# Altium project PCB_Gongkong.PrjPCB
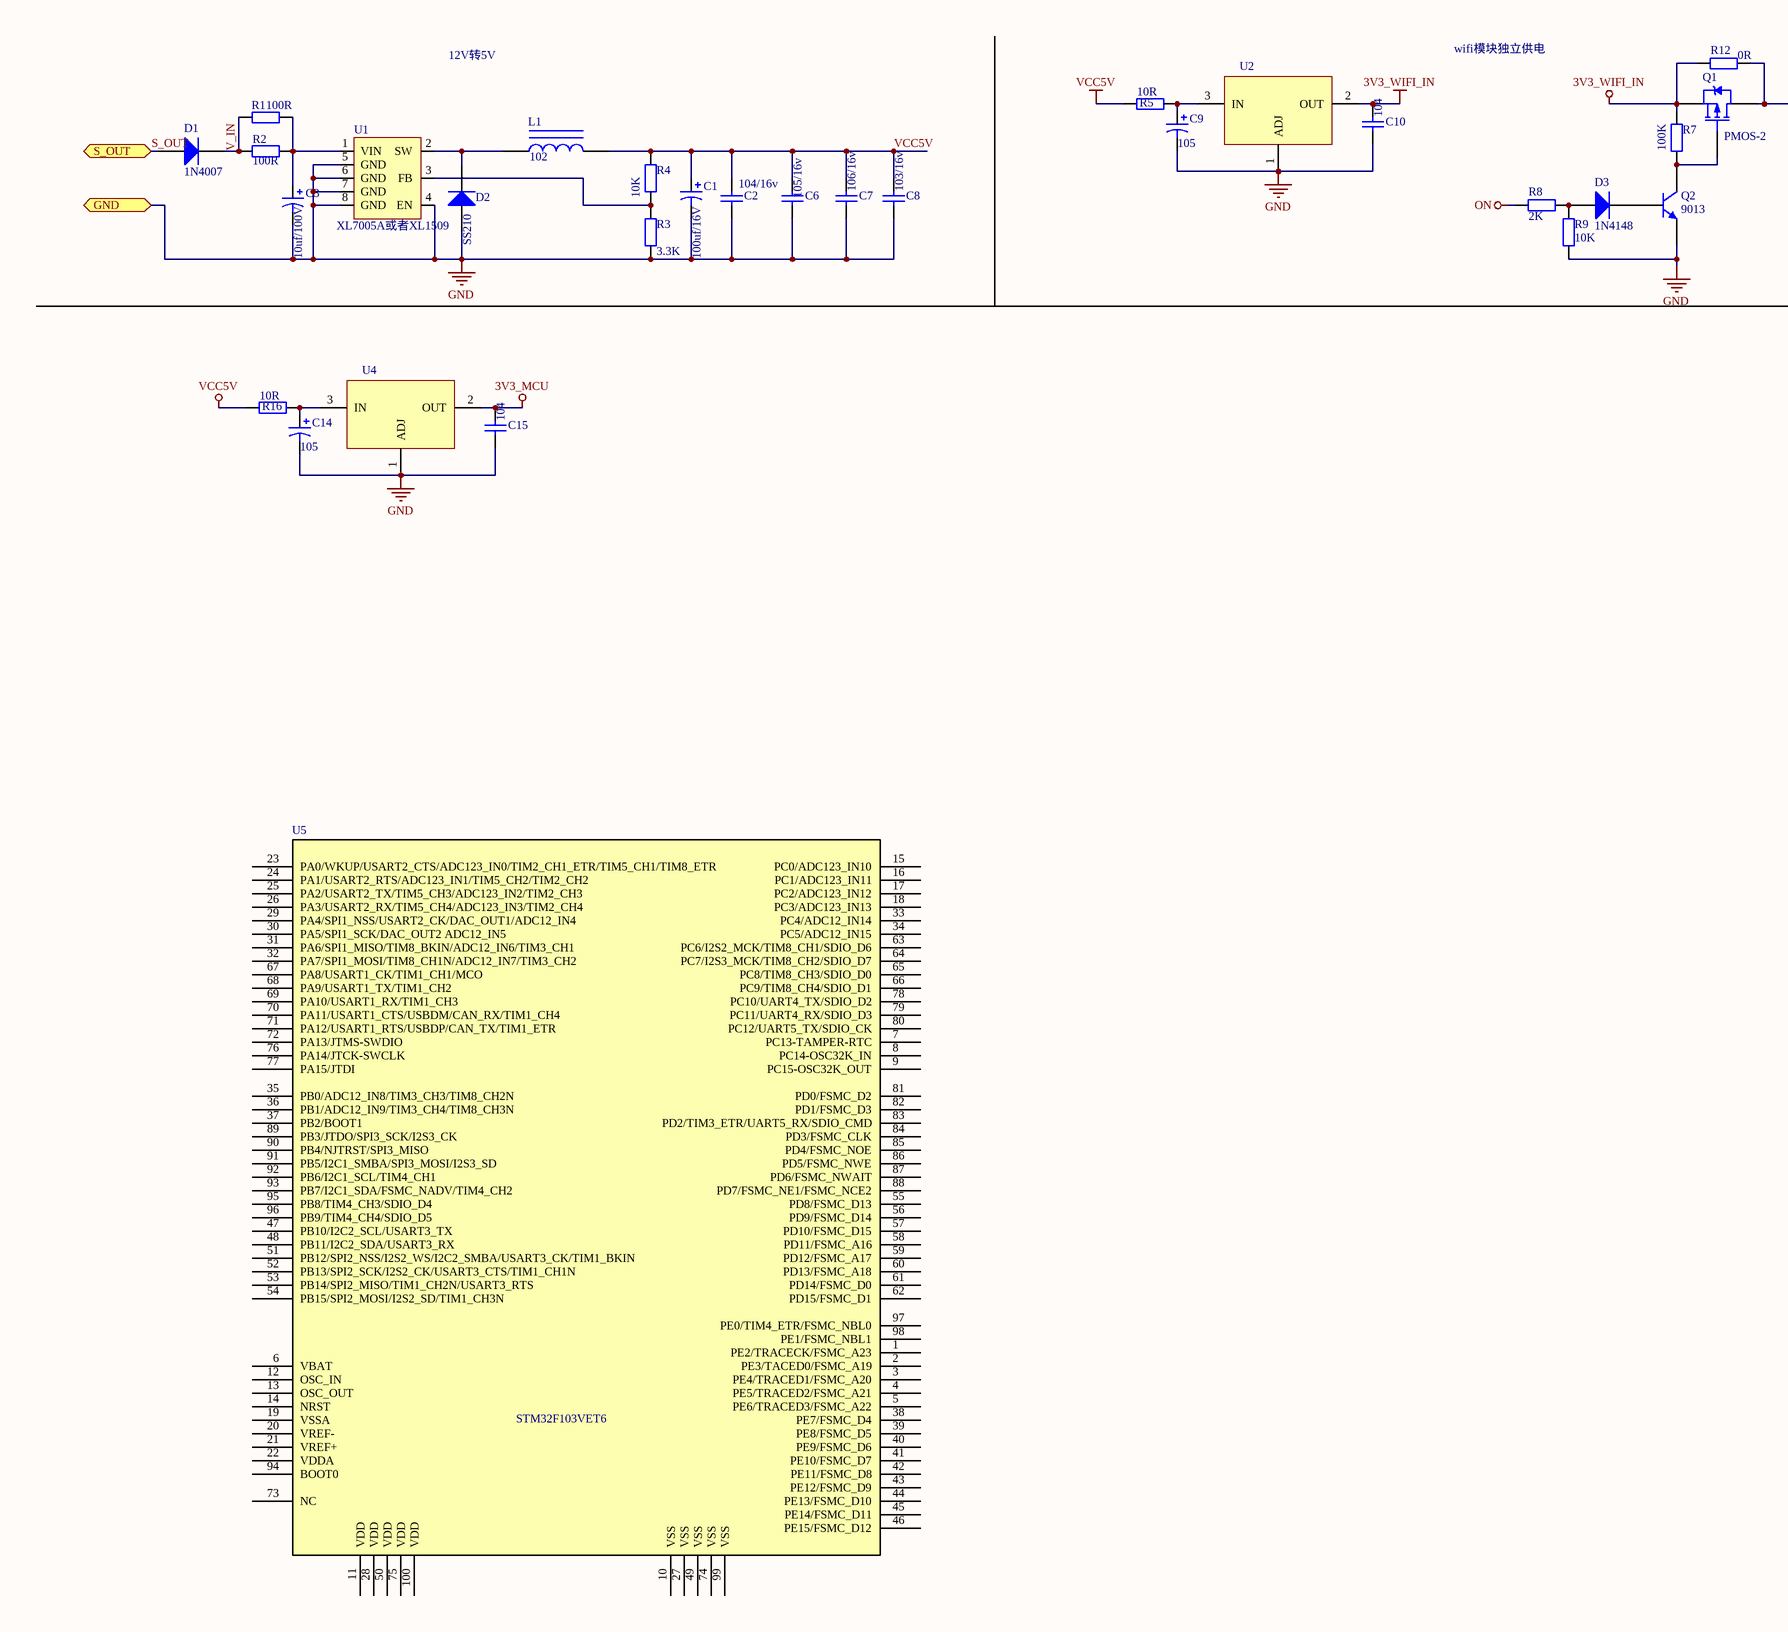
[diagram p0: GongKong.SchDoc, left]
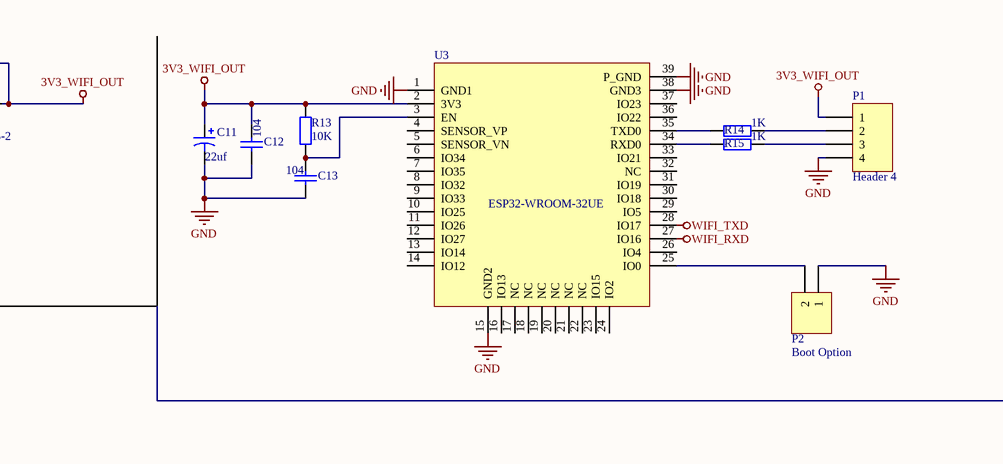
[diagram p1: GongKong.SchDoc, right]
1 sheet, 39 parts. Net scope: flat (ports and power ports of the same name join across sheets).

## Sheet GongKong.SchDoc
size A2

### Parts
C1  value 100uf/16V  [47uf/25V]  (hidden comment: Cap Pol1)
C2  value 104/16v  [0805-JT]  (hidden comment: Cap)
C3  value 10uf/100V  [47uf/25V]  (hidden comment: Cap Pol1)
C6  value 105/16v  [0805-JT]  (hidden comment: Cap)
C7  value 106/16v  [0805-JT]  (hidden comment: Cap)
C8  value 103/16v  [0805-JT]  (hidden comment: Cap)
C9  value 105  [RB7.6-15]  (hidden comment: Cap Pol1)
C10  value 104  [0805-JT]  (hidden comment: Cap)
C11  value 22uf  [RB7.6-15]  (hidden comment: Cap Pol1)
C12  value 104  [0805-JT]  (hidden comment: Cap)
C13  value 104  [0805-JT]  (hidden comment: Cap)
C14  value 105  [RB7.6-15]  (hidden comment: Cap Pol1)
C15  value 104  [0805-JT]  (hidden comment: Cap)
D1  1N4007  [M7 - WX]
D2  SS210  [M7 - WX]
D3  1N4148  [SMC]
L1  value 102  [CD54]  (hidden comment: Inductor Iron)
P1  Header 4  [HDR1X4]
P2  Boot Option  [HDR1X2]
Q1  PMOS-2  [TO-220AB]
Q2  9013  [TO-226-AA]
R1  value 100R  [1206]  (hidden comment: Res2)
R2  value 100R  [1206]  (hidden comment: Res2)
R3  value 3.3K  [0603-JT]  (hidden comment: Res2)
R4  value 10K  [0603-JT]  (hidden comment: Res2)
R5  value 10R  [1206]  (hidden comment: Res2)
R7  value 100K  [0603-JT]  (hidden comment: Res2)
R8  value 2K  [0603-JT]  (hidden comment: Res2)
R9  value 10K  [0603-JT]  (hidden comment: Res2)
R12  value 0R  [0603-JT]  (hidden comment: Res2)
R13  value 10K  [0603-JT]  (hidden comment: Res2)
R14  value 1K  [0603-JT]  (hidden comment: Res2)
R15  value 1K  [0603-JT]  (hidden comment: Res2)
R16  value 10R  [1206]  (hidden comment: Res2)
U1  XL7005A或者XL1509  [SOP8]
U2  1117_3V3  [SOT-223-jt]  (value not drawn)
U3  ESP32-WROOM-32UE  (value not drawn)
U4  1117_3V3  [SOT-223-jt]  (value not drawn)
U5  STM32F103VET6  [LQFP-100]

### Ports
GND, S_OUT

### Nets
3V3_MCU: C15.2 U4.2(OUT)
3V3_WIFI_IN: C10.2 Q1.3(S) R7.1 R12.2 U2.2(OUT)
3V3_WIFI_OUT: C11.1 C12.2 P1.1 Q1.2(D) R12.1 R13.1 U3.2(3V3)
GND: C1.2 C2.1 C3.2 C6.1 C7.1 C8.1 C9.2 C10.1 C11.2 C12.1 C13.1 C14.2 C15.1 D2.1(A) P1.4 P2.1 Q2.3(E) R3.2 R9.1 U1.4(EN) U1.5(GND) U1.6(GND) U1.7(GND) U1.8(GND) U2.1(ADJ) U3.1(GND1) U3.15(GND2) U3.38(GND3) U3.39(P_GND) U4.1(ADJ) ; port GND
ON: R8.1
VCC5V: C1.1 C2.2 C6.2 C7.2 C8.2 L1.2 R4.1 R5.1 R16.1
WIFI_RXD: U3.27(IO16)
WIFI_TXD: U3.28(IO17)
S_OUT: D1.1(A) ; port S_OUT
V_IN: D1.2(K) R1.1 R2.1
NetC3_1: C3.1 R1.2 R2.2 U1.1(VIN)
NetC9_1: C9.1 R5.2 U2.3(IN)
NetC13_2: C13.2 R13.2 U3.3(EN)
NetC14_1: C14.1 R16.2 U4.3(IN)
NetD2_2: D2.2(K) L1.1 U1.2(SW)
NetD3_1: D3.1(A) R8.2 R9.2
NetD3_2: D3.2(K) Q2.2(B)
NetP1_2: P1.2 R14.2
NetP1_3: P1.3 R15.2
NetP2_2: P2.2 U3.25(IO0)
NetQ1_1: Q1.1(G) Q2.1(C) R7.2
NetR3_1: R3.1 R4.2 U1.3(FB)
NetR14_1: R14.1 U3.35(TXD0)
NetR15_1: R15.1 U3.34(RXD0)

Not connected (* = marked no-connect by the designer): U3 4(SENSOR_VP) 5(SENSOR_VN) 6(IO34) 7(IO35) 8(IO32) 9(IO33) 10(IO25) 11(IO26) 12(IO27) 13(IO14) 14(IO12) 16(IO13) 17(NC) 18(NC) 19(NC) 20(NC) 21(NC) 22(NC) 23(IO15) 24(IO2) 26(IO4) 29(IO5) 30(IO18) 31(IO19) 32(NC) 33(IO21) 36(IO22) 37(IO23); U5 1(PE2/TRACECK/FSMC_A23) 2(PE3/TACED0/FSMC_A19) 3(PE4/TRACED1/FSMC_A20) 4(PE5/TRACED2/FSMC_A21) 5(PE6/TRACED3/FSMC_A22) 6(VBAT) 7(PC13-TAMPER-RTC) 8(PC14-OSC32K_IN) 9(PC15-OSC32K_OUT) 10(VSS) 11(VDD) 12(OSC_IN) 13(OSC_OUT) 14(NRST) 15(PC0/ADC123_IN10) 16(PC1/ADC123_IN11) 17(PC2/ADC123_IN12) 18(PC3/ADC123_IN13) 19(VSSA) 20(VREF-) 21(VREF+) 22(VDDA) 23(PA0/WKUP/USART2_CTS/ADC123_IN0/TIM2_CH1_ETR/TIM5_CH1/TIM8_ETR) 24(PA1/USART2_RTS/ADC123_IN1/TIM5_CH2/TIM2_CH2) 25(PA2/USART2_TX/TIM5_CH3/ADC123_IN2/TIM2_CH3) 26(PA3/USART2_RX/TIM5_CH4/ADC123_IN3/TIM2_CH4) 27(VSS) 28(VDD) 29(PA4/SPI1_NSS/USART2_CK/DAC_OUT1/ADC12_IN4) 30(PA5/SPI1_SCK/DAC_OUT2_ADC12_IN5) 31(PA6/SPI1_MISO/TIM8_BKIN/ADC12_IN6/TIM3_CH1) 32(PA7/SPI1_MOSI/TIM8_CH1N/ADC12_IN7/TIM3_CH2) 33(PC4/ADC12_IN14) 34(PC5/ADC12_IN15) 35(PB0/ADC12_IN8/TIM3_CH3/TIM8_CH2N) 36(PB1/ADC12_IN9/TIM3_CH4/TIM8_CH3N) 37(PB2/BOOT1) 38(PE7/FSMC_D4) 39(PE8/FSMC_D5) 40(PE9/FSMC_D6) 41(PE10/FSMC_D7) 42(PE11/FSMC_D8) 43(PE12/FSMC_D9) 44(PE13/FSMC_D10) 45(PE14/FSMC_D11) 46(PE15/FSMC_D12) 47(PB10/I2C2_SCL/USART3_TX) 48(PB11/I2C2_SDA/USART3_RX) 49(VSS) 50(VDD) 51(PB12/SPI2_NSS/I2S2_WS/I2C2_SMBA/USART3_CK/TIM1_BKIN) 52(PB13/SPI2_SCK/I2S2_CK/USART3_CTS/TIM1_CH1N) 53(PB14/SPI2_MISO/TIM1_CH2N/USART3_RTS) 54(PB15/SPI2_MOSI/I2S2_SD/TIM1_CH3N) 55(PD8/FSMC_D13) 56(PD9/FSMC_D14) 57(PD10/FSMC_D15) 58(PD11/FSMC_A16) 59(PD12/FSMC_A17) 60(PD13/FSMC_A18) 61(PD14/FSMC_D0) 62(PD15/FSMC_D1) 63(PC6/I2S2_MCK/TIM8_CH1/SDIO_D6) 64(PC7/I2S3_MCK/TIM8_CH2/SDIO_D7) 65(PC8/TIM8_CH3/SDIO_D0) 66(PC9/TIM8_CH4/SDIO_D1) 67(PA8/USART1_CK/TIM1_CH1/MCO) 68(PA9/USART1_TX/TIM1_CH2) 69(PA10/USART1_RX/TIM1_CH3) 70(PA11/USART1_CTS/USBDM/CAN_RX/TIM1_CH4) 71(PA12/USART1_RTS/USBDP/CAN_TX/TIM1_ETR) 72(PA13/JTMS-SWDIO) 73(NC) 74(VSS) 75(VDD) 76(PA14/JTCK-SWCLK) 77(PA15/JTDI) 78(PC10/UART4_TX/SDIO_D2) 79(PC11/UART4_RX/SDIO_D3) 80(PC12/UART5_TX/SDIO_CK) 81(PD0/FSMC_D2) 82(PD1/FSMC_D3) 83(PD2/TIM3_ETR/UART5_RX/SDIO_CMD) 84(PD3/FSMC_CLK) 85(PD4/FSMC_NOE) 86(PD5/FSMC_NWE) 87(PD6/FSMC_NWAIT) 88(PD7/FSMC_NE1/FSMC_NCE2) 89(PB3/JTDO/SPI3_SCK/I2S3_CK) 90(PB4/NJTRST/SPI3_MISO) 91(PB5/I2C1_SMBA/SPI3_MOSI/I2S3_SD) 92(PB6/I2C1_SCL/TIM4_CH1) 93(PB7/I2C1_SDA/FSMC_NADV/TIM4_CH2) 94(BOOT0) 95(PB8/TIM4_CH3/SDIO_D4) 96(PB9/TIM4_CH4/SDIO_D5) 97(PE0/TIM4_ETR/FSMC_NBL0) 98(PE1/FSMC_NBL1) 99(VSS) 100(VDD)

### Notes on the sheet
- 12V转5V
- wifi模块独立供电

### Library data of the parts
C1 C3 C9 C11 C14 = Cap Pol1: Polarized Capacitor (Radial); Published: 8-Jun-2000; LatestRevisionDate: 17-Jul-2002; LatestRevisionNote: Re-released for DXP Platform.; PackageReference: RB7.6-15; Publisher: Altium Limited; PackageDescription: Polarized Capacitor (Radial); 2 Leads
C2 C6-C8 C10 C12 C13 C15 = Cap: Capacitor; Published: 8-Jun-2000; LatestRevisionDate: 17-Jul-2002; LatestRevisionNote: Re-released for DXP Platform.; PackageReference: RAD-0.3; Publisher: Altium Limited; PackageDescription: Radial Cap, Thru-Hole; 2 Leads; 0.3 in Pin Spacing
D1 D2 = Diode 1N4148: High Conductance Fast Diode; pin to pad: 1>A 2>K; Published: 8-Jun-2000; LatestRevisionDate: 17-Jul-2002; LatestRevisionNote: Re-released for DXP Platform.; DatasheetVersion: 1997; PackageReference: DO-35; Publisher: Altium Limited; PackageDescription: Diode, Axial; Body 3.8 x 1.9 mm (LxDia. max), Lead Dia. 0.53 mm (max); Code_JEDEC: DO-204-AH; ComponentLink1Description: Manufacturer Link; ComponentLink1URL: http://www.fairchildsemi.com/; ComponentLink2Description: Datasheet; ComponentLink2URL: http://www.fairchildsemi.com/ds/1N%2F1N4148.pdf
D3 = Diode: Default Diode; Published: 8-Jun-2000; LatestRevisionDate: 17-Jul-2002; LatestRevisionNote: Re-released for DXP Platform.; PackageVersion: Sep-1996; PackageReference: SMC; Publisher: Altium Limited; PackageDescription: DO-214-AB/SMC; 2 C-Bend Leads; Body 7.9 x 5.9 mm, inc. leads (LxW); Code_JEDEC: DO-214-AB
L1 = Inductor Iron: Magnetic-Core Inductor; Published: 24-Mar-1999; LatestRevisionDate: 17-Jul-2002; LatestRevisionNote: Re-released for DXP Platform.; PackageReference: AXIAL-0.9; Publisher: Altium Limited; PackageDescription: Axial Device, Thru-Hole; 2 Leads; 0.9 in Pin Spacing
P1 = Header 4: Header, 4-Pin; LatestRevisionDate: 17-Jul-2002; LatestRevisionNote: Re-released for DXP Platform.; Publisher: Altium Limited
P2 = Header 2: Header, 2-Pin; LatestRevisionDate: 17-Jul-2002; LatestRevisionNote: Re-released for DXP Platform.; Publisher: Altium Limited
Q1 = PMOS-2: P-Channel Power MOSFET; Note: Pin 4 not drawn and electrically connected to Pin 2.; Published: 8-Jun-2000; LatestRevisionDate: 17-Jul-2002; LatestRevisionNote: Re-released for DXP Platform.; DatasheetVersion: PD-9.390D; PackageVersion: Feb-1997; PackageReference: TO-220AB; Publisher: Altium Limited; PackageDescription: TO, Thru-Hole, Vertical, Heatsink Mounted; 3 In-Line Leads; Pitch 2.54 mm; ComponentLink1Description: Manufacturer Link; ComponentLink1URL: http://www.irf.com/
Q2 = NPN: NPN Bipolar Transistor; Published: 8-Jun-2000; LatestRevisionDate: 17-Jul-2002; LatestRevisionNote: Re-released for DXP Platform.; PackageReference: TO-226-AA; Publisher: Altium Limited; PackageDescription: TO, Flat Index; 3 In-Line, Axial Leads; Body Dia. 4.8mm; Leads 0.55 x 0.51 mm (max); Code_JEDEC: TO-226-AA
R1-R5 R7-R9 R12-R16 = Res2: Resistor; Published: 8-Jun-2000; LatestRevisionDate: 17-Jul-2002; LatestRevisionNote: Re-released for DXP Platform.; PackageReference: AXIAL-0.4; Publisher: Altium Limited; PackageDescription: Axial Device, Thru-Hole; 2 Leads; 0.4 in Pin Spacing
U1 = XL7005
U2 U4 = 1117_3V3: 3.3V   LDO芯片
U3 = ESP32-WROOM-32UE: ESP32 wifi模块 IPEX接口天线
U5 = STM32F103VET